# EAGLE schematic BZ System (EAGLE 7.5.0)
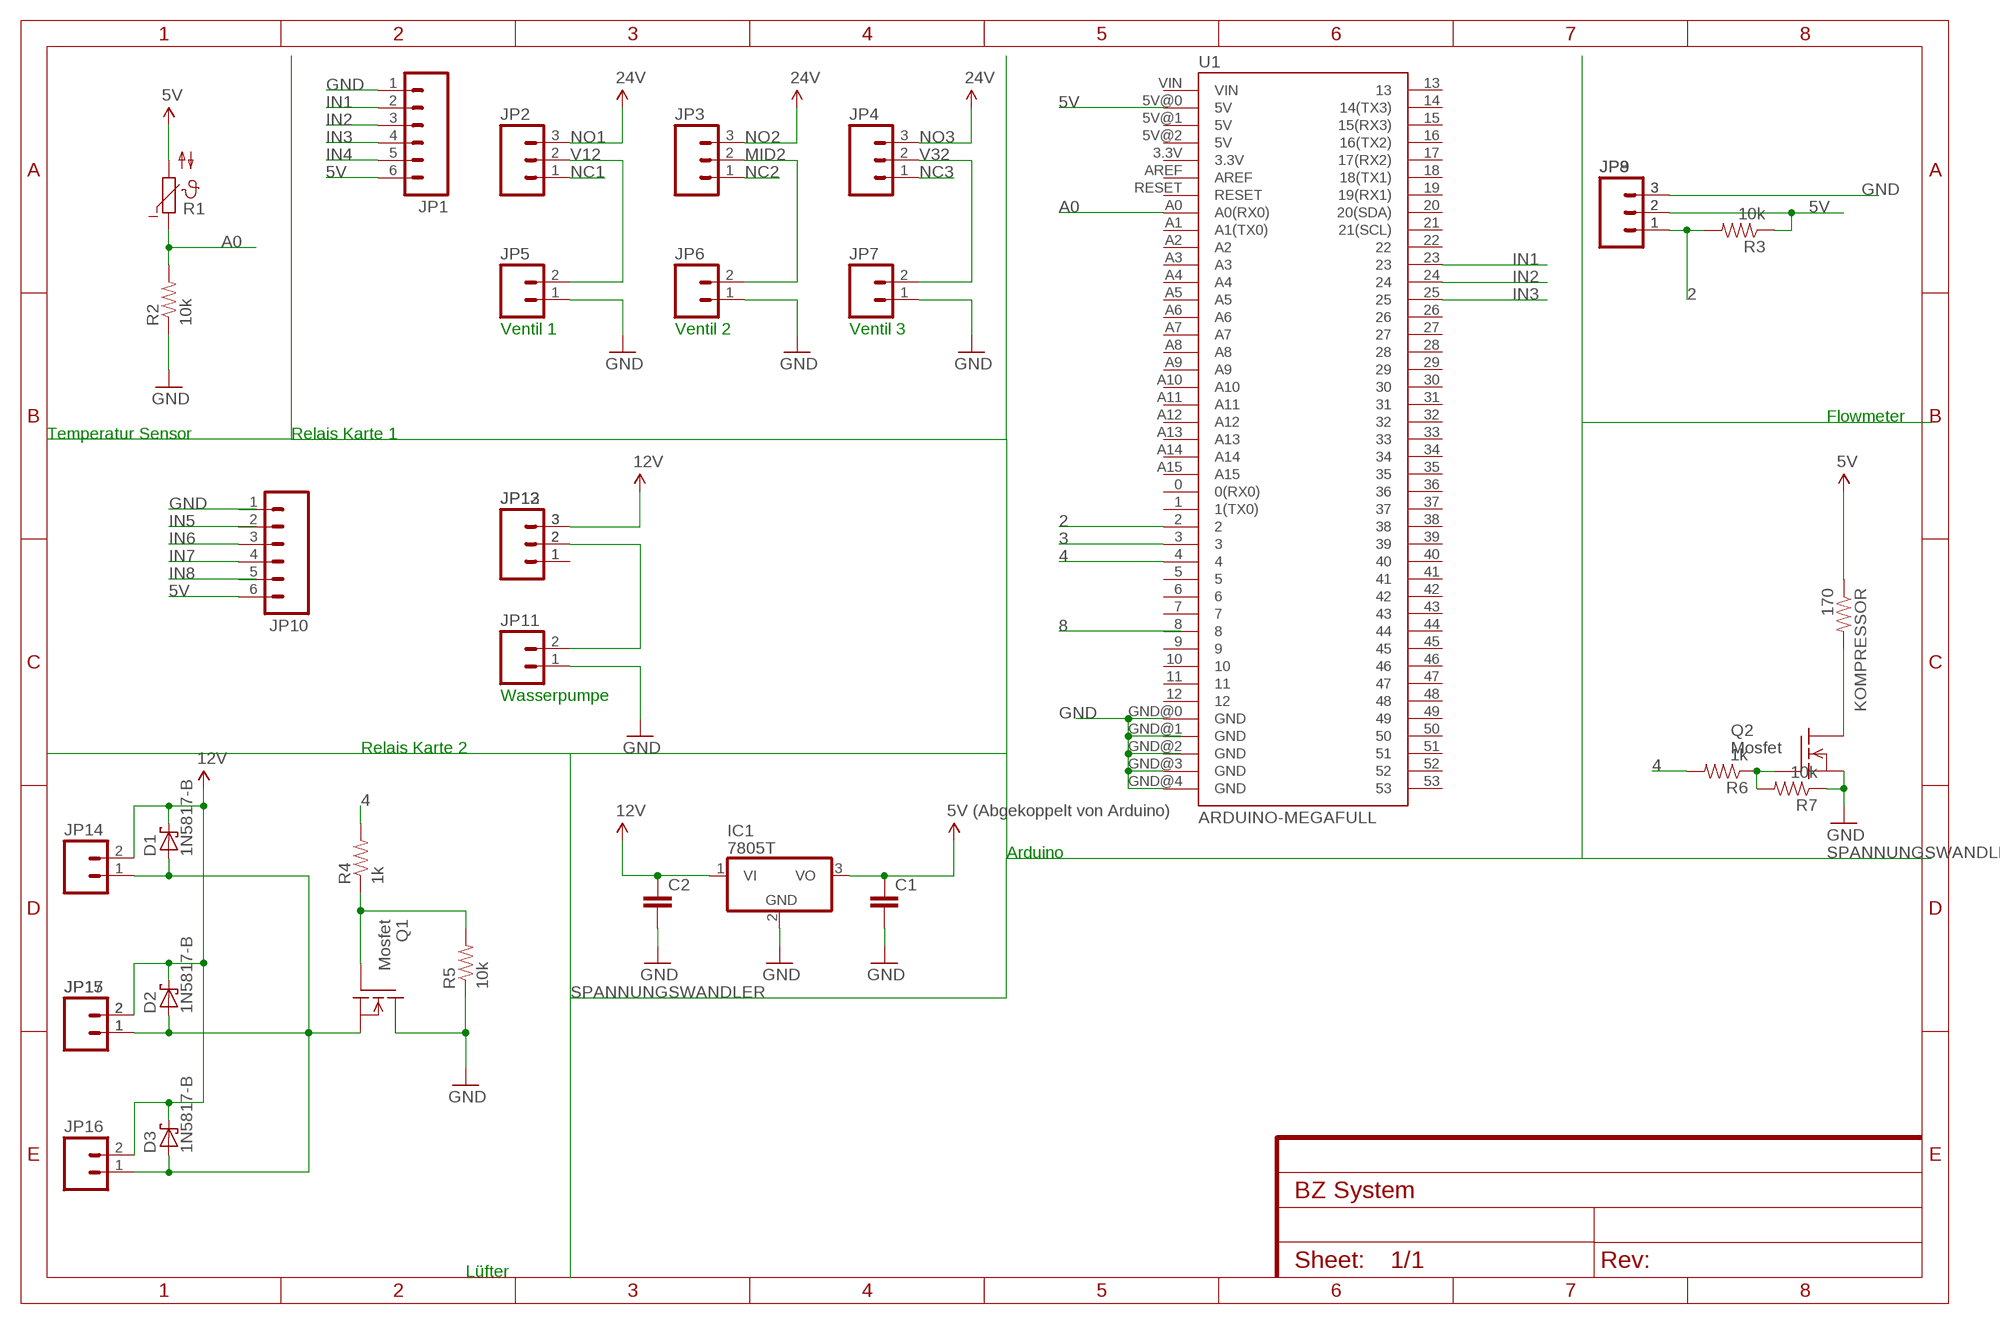
[diagram p0: schematic, sheet 1]

## Parts
C1  C2,5-3  [C2.5-3]
C2  C2,5-3  [C2.5-3]
D1  1N5817-B  [DO41-7.6]
D2  1N5817-B  [DO41-7.6]
D3  1N5817-B  [DO41-7.6]
IC1  7805T  [TO220H]
JP1  M06POLAR  [MOLEX-1X6]
JP2  M03POLAR  [MOLEX-1X3]
JP3  M03POLAR  [MOLEX-1X3]
JP4  M03POLAR  [MOLEX-1X3]
JP5  M02POLAR  [MOLEX-1X2]
JP6  M02POLAR  [MOLEX-1X2]
JP7  M02POLAR  [MOLEX-1X2]
JP8  M03POLAR  [MOLEX-1X3]
JP9  M03POLAR  [MOLEX-1X3]
JP10  M06POLAR  [MOLEX-1X6]
JP11  M02POLAR  [MOLEX-1X2]
JP12  M03POLAR  [MOLEX-1X3]
JP13  M03POLAR  [MOLEX-1X3]
JP14  M02POLAR  [MOLEX-1X2]
JP15  M02POLAR  [MOLEX-1X2]
JP16  M02POLAR  [MOLEX-1X2]
JP17  M02POLAR  [MOLEX-1X2]
KOMPRESSOR  170  RESISTORAXIAL-0.3  [AXIAL-0.3]
Q1  Mosfet  BUZ11  [TO220]
Q2  Mosfet  BUZ11  [TO220]
R1  NTC642-6  [P642]
R2  10k  RESISTORAXIAL-0.3  [AXIAL-0.3]
R3  10k  RESISTORAXIAL-0.3  [AXIAL-0.3]
R4  1k  RESISTORAXIAL-0.3  [AXIAL-0.3]
R5  10k  RESISTORAXIAL-0.3  [AXIAL-0.3]
R6  1k  RESISTORAXIAL-0.3  [AXIAL-0.3]
R7  10k  RESISTORAXIAL-0.3  [AXIAL-0.3]
U1  ARDUINO-MEGAFULL  [ARDUINO_MEGA]

## Nets
2: JP8.1 JP9.1 R3.P$2 U1.2
4: R4.P$2 U1.4
5V: C1.1 IC1.3(VO) JP1.6 JP8.2 JP9.2 JP10.6 R1.2 R3.P$1 U1.5V@0(5V) ; supply symbol labelled 5V (Abgekoppelt von Arduino)
12V: C2.1 IC1.1(VI) JP12.3 JP13.3
+DIODE1: D1.C D2.C D3.C JP14.2 JP15.2 JP16.2 JP17.2 ; supply symbol labelled 12V
-DOIDE1: D1.A D2.A D3.A JP14.1 JP15.1 JP16.1 JP17.1 Q1.3(S)
A0: R1.1 R2.P$2 U1.A0(A0(RX0))
GND: C1.2 C2.2 IC1.2(GND) JP1.1 JP8.3 JP9.3 JP11.1 Q1.2(D) Q2.3(S) R2.P$1 R5.P$1 R7.P$1 U1.GND@0(GND) U1.GND@3(GND) U1.GND@4(GND)
IN1: JP1.2 U1.23
IN2: JP1.3 U1.24
IN3: JP1.4 U1.25
IN4: JP1.5
IN6: JP10.3
IN7: JP10.4
MID2: JP3.2 JP6.2
N$1: Q2.1(G) R6.P$1 R7.P$2
N$2: JP12.1 JP13.1
N$3: JP11.2 JP12.2 JP13.2
N$4: KOMPRESSOR.P$2 Q2.2(D)
N$5: Q1.1(G) R4.P$1 R5.P$2
N$6: R6.P$2
N$7: KOMPRESSOR.P$1 ; supply symbol labelled 5V
NC1: JP2.1
NC2: JP3.1
NC3: JP4.1
NO1: JP2.3 ; supply symbol labelled 24V
NO2: JP3.3 ; supply symbol labelled 24V
NO3: JP4.3 ; supply symbol labelled 24V
V11: JP5.1 ; supply symbol labelled GND
V12: JP2.2 JP5.2
V21: JP6.1 ; supply symbol labelled GND
V31: JP7.1 ; supply symbol labelled GND
V32: JP4.2 JP7.2
Unconnected: JP10.1 JP10.2 JP10.5 U1.0(0(RX0)) U1.1(1(TX0)) U1.3 U1.3.3V U1.5 U1.5V@1(5V) U1.5V@2(5V) U1.6 U1.7 U1.8 U1.9 U1.10 U1.11 U1.12 U1.13 U1.14(14(TX3)) U1.15(15(RX3)) U1.16(16(TX2)) U1.17(17(RX2)) U1.18(18(TX1)) U1.19(19(RX1)) U1.20(20(SDA)) U1.21(21(SCL)) U1.22 U1.26 U1.27 U1.28 U1.29 U1.30 U1.31 U1.32 U1.33 U1.34 U1.35 U1.36 U1.37 U1.38 U1.39 U1.40 U1.41 U1.42 U1.43 U1.44 U1.45 U1.46 U1.47 U1.48 U1.49 U1.50 U1.51 U1.52 U1.53 U1.A1(A1(TX0)) U1.A2 U1.A3 U1.A4 U1.A5 U1.A6 U1.A7 U1.A8 U1.A9 U1.A10 U1.A11 U1.A12 U1.A13 U1.A14 U1.A15 U1.AREF U1.GND@1(GND) U1.GND@2(GND) U1.RESET U1.VIN

## Notes on the sheet
- Ventil 1 | Ventil 2 | Ventil 3
- Flowmeter
- Temperatur Sensor | Relais Karte 1
- Wasserpumpe
- Relais Karte 2
- Arduino
- Lüfter

## Library data of the parts
C1 C2 = capacitor-wima:C: CAPACITOR naming: grid - package width
D1-D3 = diode:1N581*: 1.0A SCHOTTKY BARRIER RECTIFIER Source: http://www.diodes.com/datasheets/ds23001.pdf
IC1 = linear:78*: Positive VOLTAGE REGULATOR Source: http://cache.national.com/ds/LM/LM78L05.pdf http://www.fairchildsemi.com/ds/LM/LM7805.pdf
JP1 JP10 = SparkFun-Connectors:M06: Header 6 Standard 6-pin 0.1" header. Use with straight break away headers (SKU : PRT-00116), right angle break away headers (PRT-00553), swiss pins (PRT-00743), machine pins (PRT-00117), and female headers (PRT-00115). Molex polarized connector foot print use with SKU : PRT-08094 with associated crimp pins and housings. NOTES ON THE VARIANTS LOCK and LOCK_LONGPADS... This footprint was designed to help hold the alignment of a through-hole component (i.e. 6-pin header) while soldering it into place. You may notice that each hole has been shifted either up or down by 0.005 of an inch from it's more standard position (which is a perfectly straight line). This slight alteration caused the pins (the squares in the middle) to touch the edges of the holes. Because they are alternating, it causes a "brace" to hold the component in place. 0.005 has proven to be the perfect amount of "off-center" position when using our standard breakaway headers. Although looks a little odd when you look at the bare footprint, once you have a header in there, the alteration is very hard to notice. Also,if you push a header all the way into place, it is covered up entirely on the bottom side. This idea of altering the position of holes to aid alignment will be further integrated into the Sparkfun Library for other footprints. It can help hold any component with 3 or more connection pins.
JP2-JP4 JP8 JP9 JP12 JP13 = SparkFun-Connectors:M03: Header 3 Standard 3-pin 0.1" header. Use with straight break away headers (SKU : PRT-00116), right angle break away headers (PRT-00553), swiss pins (PRT-00743), machine pins (PRT-00117), and female headers (PRT-00115). Molex polarized connector foot print use with SKU : PRT-08232 with associated crimp pins and housings.
JP5-JP7 JP11 JP14-JP17 = SparkFun-Connectors:M02: Standard 2-pin 0.1" header. Use with - straight break away headers ( PRT-00116) - right angle break away headers (PRT-00553) - swiss pins (PRT-00743) - machine pins (PRT-00117) - female headers (PRT-00115) Molex polarized connector foot print use with: PRT-08233 with associated crimp pins and housings. 2.54_SCREWTERM for use with PRT-10571. 3.5mm Screw Terminal footprints for PRT-08084 5mm Screw Terminal footprints for use with PRT-08432
KOMPRESSOR R2-R7 = SparkFun-Passives:RESISTOR: Resistor Basic schematic elements and footprints for 0603, 1206, and PTH resistors.
Q1 Q2 = transistor-fet:BUZ11: N-Channel Enhancement MOSFET 50V; 30A; 0,040Ohm
R1 = ptc-ntc:NTC642-6: PHILIPS NTC; OC_FARNELL: unknown; OC_NEWARK: unknown
U1 = SparkFun-Boards:ARDUINO-MEGA: Arduino Mega board footprint